# EAGLE board Module_DIO (EAGLE 9.2.1)
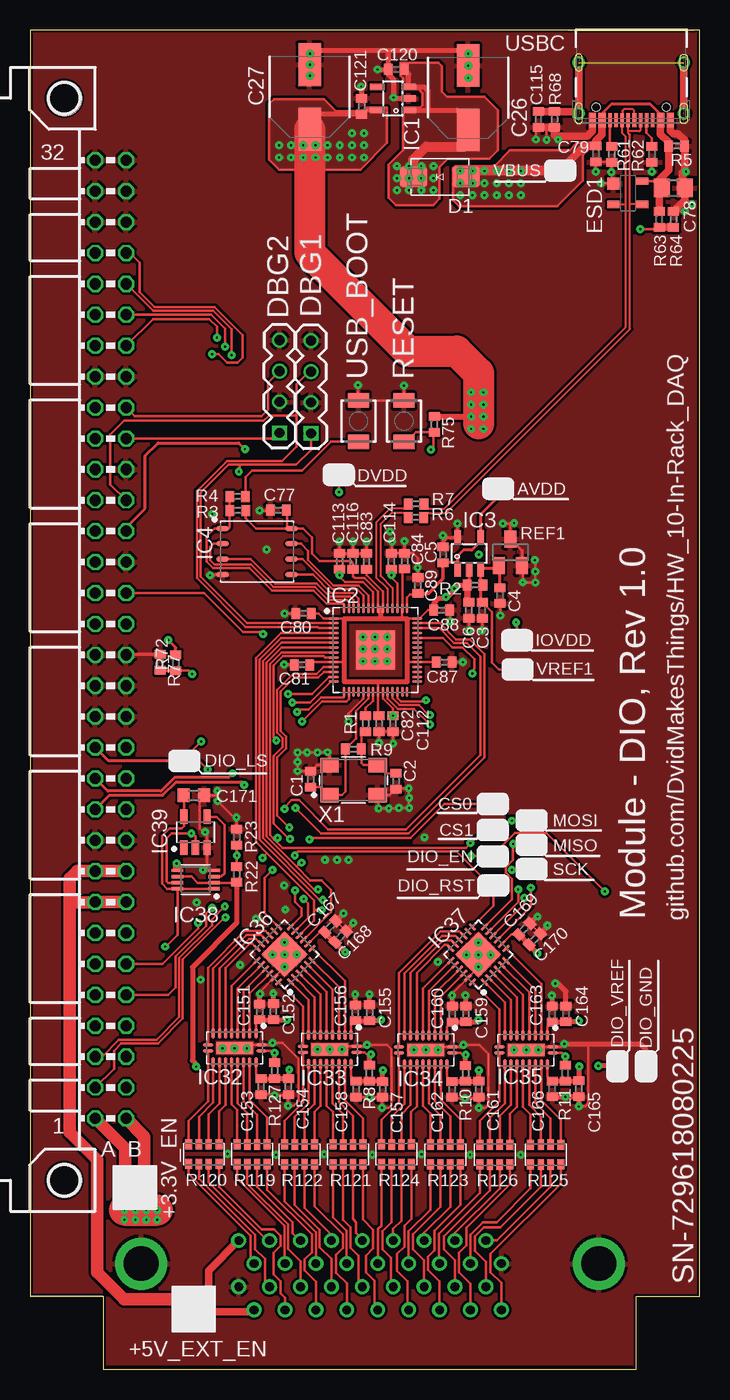
[diagram p3: board, top side]
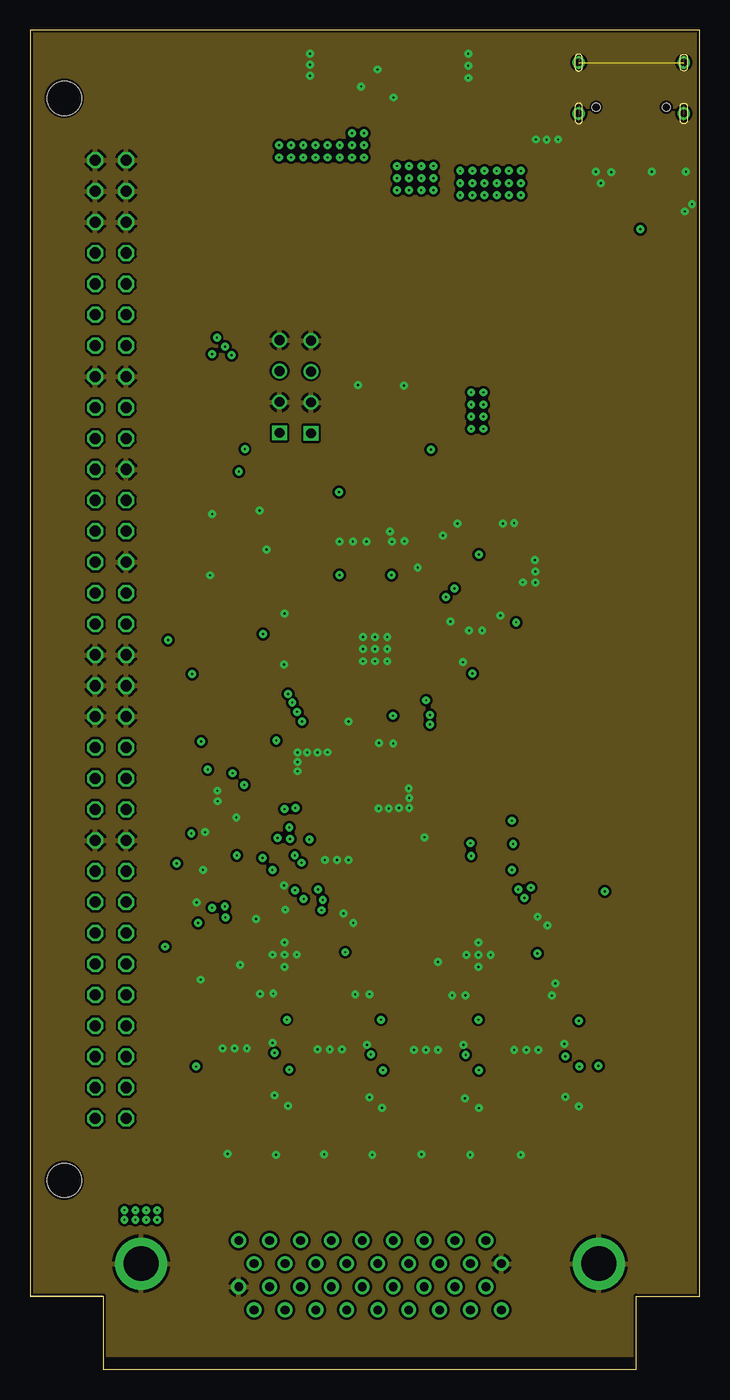
[diagram p4: board, inner layer Route2]
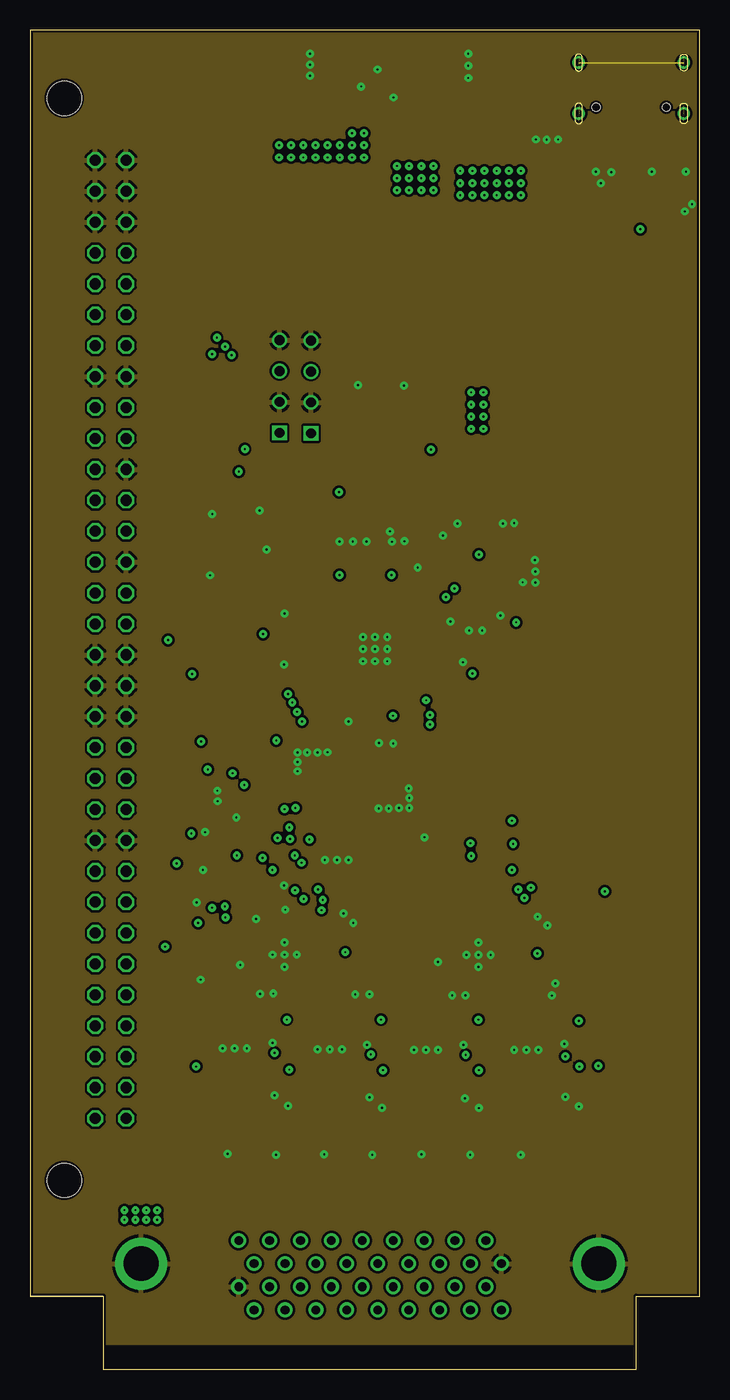
[diagram p5: board, inner layer Route15]
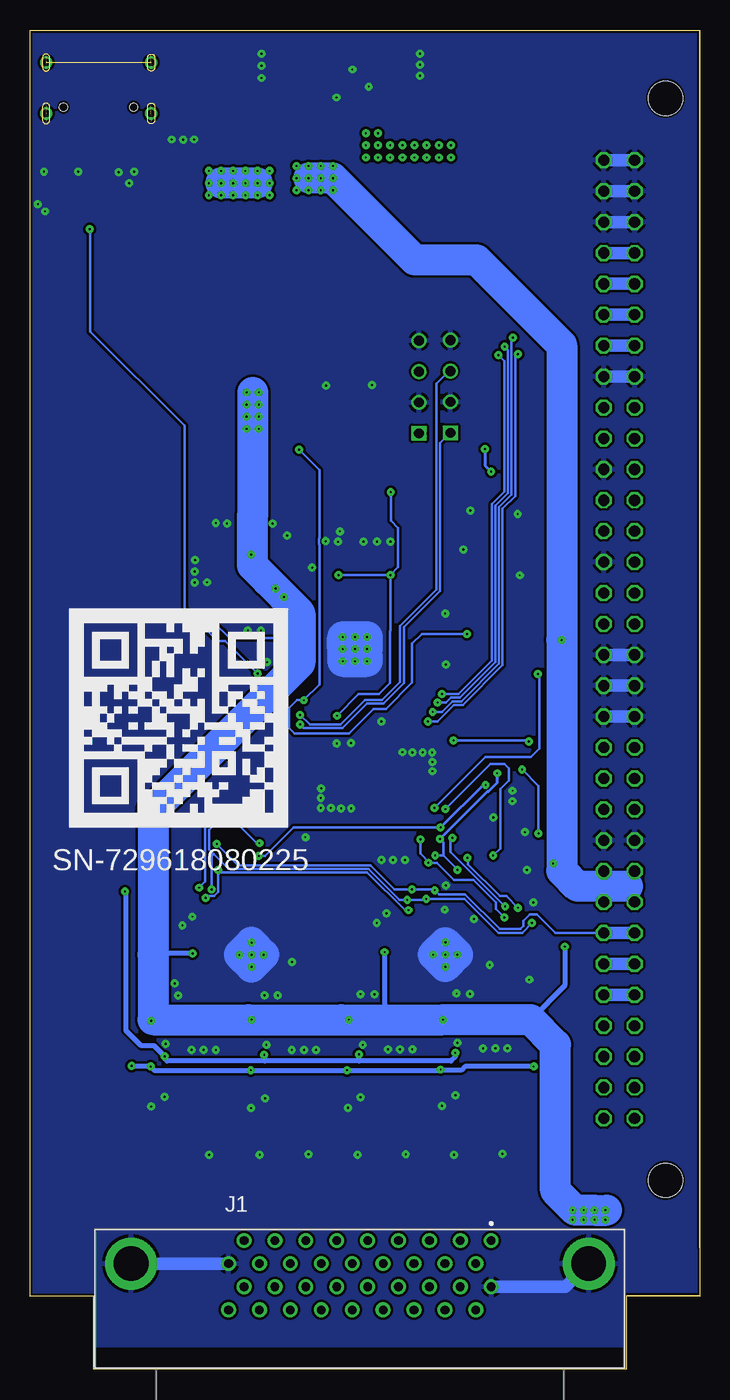
[diagram p6: board, bottom side, seen from below]

Size 55 x 110 mm. Coordinates in mm from the lower left corner, seen from the top.
Outline: 0,6 6,6
Outline: 0,6 6,6 6,0 49.8,0 49.8,6 55,6 55,110 0,110 0,6
Copper layers (1+2*15+16): Top 0.035mm / dielectric 0.0994mm / Route2 0.0152mm / dielectric 1.265mm / Route15 0.0152mm / dielectric 0.0994mm / Bottom 0.035mm
Design rules "JLC04161H-3313": minimum track width 3.5mil, minimum drill 0.15mm, track to track 3.5mil, track to pad 3.5mil, pad to pad 3.5mil, via to via 3.5mil, smd to smd 3.5mil, copper to edge 0.2mm, drill to drill 6mil, minimum pad ring 8mil, minimum via ring 0.25mm, stop-mask expansion 0.05mm, vias tented up to drill 16mil, thermal gap 10mil
Net classes: 1 50R_DIFFPAIR: width 0.4 mm, drill 0.15 mm, clearance 0.203 mm; 2 90R_DIFFPAIR: width 0.155 mm, drill 0.15 mm, clearance 0.191 mm; 3 100R_DIFFPAIR: width 0.221 mm, drill 0.15 mm, clearance 0.203 mm

## Footprints (pad centres in the part's own frame; a part is rotated, then mirrored left to right if it is on the bottom)
TP = smd 2.2 x 1.4: TP 0,0
C0402 = smd 0.7 x 0.9: 1 -0.65,0; 2 0.65,0
100UF-16V = smd 3.5 x 1.85: 1 -2.65,0; 2 2.65,0
0805 = smd 1.3 x 1.5: 1 -0.95,0; 2 0.95,0
0402 = smd 0.7 x 0.9: 1 -0.65,0; 2 0.65,0
C0603 = smd 1 x 1.1: 1 -0.85,0; 2 0.85,0
SMA = smd 2.28 x 1.66: A 2.165,0; C -2.165,0
1X4 = drill 0.8 square: 1 0,3.81 | drill 0.8: 2 0,1.27; 3 0,-1.27; 4 0,-3.81
SOT143 = smd 1 x 1: 1 -0.75,-1.2 | smd 0.6 x 1: 2 0.95,-1.2; 3 0.95,1.2; 4 -0.95,1.2
SOT23-5 = smd 0.55 x 1.2: 1 -0.95,-1.3; 2 0,-1.3; 3 0.95,-1.3; 4 0.95,1.3; 5 -0.95,1.3
QFN40P700X700X100-57T510 = smd 0.837 x 0.22: 1 -3.437,2.6; 2 -3.437,2.2; 3 -3.437,1.8; 4 -3.437,1.4; 5 -3.437,1; 6 -3.437,0.6; 7 -3.437,0.2; 8 -3.437,-0.2; 9 -3.437,-0.6; 10 -3.437,-1; 11 -3.437,-1.4; 12 -3.437,-1.8; 13 -3.437,-2.2; 14 -3.437,-2.6; 29 3.437,-2.6; 30 3.437,-2.2; 31 3.437,-1.8; 32 3.437,-1.4; 33 3.437,-1; 34 3.437,-0.6; 35 3.437,-0.2; 36 3.437,0.2; 37 3.437,0.6; 38 3.437,1; 39 3.437,1.4; 40 3.437,1.8; 41 3.437,2.2; 42 3.437,2.6 | smd 0.22 x 0.837: 15 -2.6,-3.437; 16 -2.2,-3.437; 17 -1.8,-3.437; 18 -1.4,-3.437; 19 -1,-3.437; 20 -0.6,-3.437; 21 -0.2,-3.437; 22 0.2,-3.437; 23 0.6,-3.437; 24 1,-3.437; 25 1.4,-3.437; 26 1.8,-3.437; 27 2.2,-3.437; 28 2.6,-3.437; 43 2.6,3.437; 44 2.2,3.437; 45 1.8,3.437; 46 1.4,3.437; 47 1,3.437; 48 0.6,3.437; 49 0.2,3.437; 50 -0.2,3.437; 51 -0.6,3.437; 52 -1,3.437; 53 -1.4,3.437; 54 -1.8,3.437; 55 -2.2,3.437; 56 -2.6,3.437 | smd 3.2 x 3.2: 57 0,0
SON127P600X500X75-8N = smd 1.012 x 0.432: 1 -2.85,1.905; 2 -2.85,0.635; 3 -2.85,-0.635; 4 -2.85,-1.905; 5 2.85,-1.905; 6 2.85,-0.635; 7 2.85,0.635; 8 2.85,1.905
VQFN20 = smd 0.27 x 0.838: 1 -0.25,2.196; 10 -0.25,-2.196; 11 0.25,-2.196; 20 0.25,2.196 | smd 0.838 x 0.27: 2 -1.196,1.75; 3 -1.196,1.25; 4 -1.196,0.75; 5 -1.196,0.25; 6 -1.196,-0.25; 7 -1.196,-0.75; 8 -1.196,-1.25; 9 -1.196,-1.75; 12 1.196,-1.75; 13 1.196,-1.25; 14 1.196,-0.75; 15 1.196,-0.25; 16 1.196,0.25; 17 1.196,0.75; 18 1.196,1.25; 19 1.196,1.75 | smd 1 x 3: PAD 0,0
QFN50P400X400X100-25T265 = smd 0.811 x 0.264: 1 -1.951,1.25; 2 -1.951,0.75; 3 -1.951,0.25; 4 -1.951,-0.25; 5 -1.951,-0.75; 6 -1.951,-1.25; 13 1.951,-1.25; 14 1.951,-0.75; 15 1.951,-0.25; 16 1.951,0.25; 17 1.951,0.75; 18 1.951,1.25 | smd 0.264 x 0.811: 7 -1.25,-1.951; 8 -0.75,-1.951; 9 -0.25,-1.951; 10 0.25,-1.951; 11 0.75,-1.951; 12 1.25,-1.951; 19 1.25,1.951; 20 0.75,1.951; 21 0.25,1.951; 22 -0.25,1.951; 23 -0.75,1.951; 24 -1.25,1.951 | smd 2.65 x 2.65: 25 0,0
SOP50P310X90-8N = smd 0.923 x 0.268: 1 -1.503,0.75; 2 -1.503,0.25; 3 -1.503,-0.25; 4 -1.503,-0.75; 5 1.503,-0.75; 6 1.503,-0.25; 7 1.503,0.25; 8 1.503,0.75
SOT95P280X145-5N = smd 1.186 x 0.597: 1 -1.264,0.95; 2 -1.264,0; 3 -1.264,-0.95; 4 1.264,-0.95; 5 1.264,0.95
MDB36 = drill 0.71 pad 1.217: 1 10.16,8.89; 2 8.89,6.99; 3 7.62,8.89; 4 6.35,6.99; 5 5.08,8.89; 6 3.81,6.99; 7 2.54,8.89; 8 1.27,6.99; 9 0,8.89; 10 -1.27,6.99; 11 -2.54,8.89; 12 -3.81,6.99; 13 -5.08,8.89; 14 -6.35,6.99; 15 -7.62,8.89; 16 -8.89,6.99; 17 -10.16,8.89; 18 -11.43,6.99; 19 10.16,5.09; 20 8.89,3.19; 21 7.62,5.09; 22 6.35,3.19; 23 5.08,5.09; 24 3.81,3.19; 25 2.54,5.09; 26 1.27,3.19; 27 0,5.09; 28 -1.27,3.19; 29 -2.54,5.09; 30 -3.81,3.19; 31 -5.08,5.09; 32 -6.35,3.19; 33 -7.62,5.09; 34 -8.89,3.19; 35 -10.16,5.09; 36 -11.43,3.19 | drill 2.85 pad 4.275: MH1 18.17,6.99; MH2 -19.44,6.99
0603 = smd 1 x 1.1: 1 -0.85,0; 2 0.85,0
YC164-JR-0733RL = smd 0.67 x 0.85: 1 -1.24,-0.81; 4 1.24,-0.81; 5 1.24,0.81; 8 -1.24,0.81 | smd 0.59 x 0.85: 2 -0.4,-0.81; 3 0.4,-0.81; 6 0.4,0.81; 7 -0.4,0.81
SOT23 = smd 1 x 1.4: 1 -0.95,-1.1; 2 0.95,-1.1; 3 0,1.1
SWITCH-OMRON_B3U-1000P = smd 1.2 x 1.7: 1 -1.7,0; 2 1.7,0
629722000214 = smd 0.3 x 1.15: A1 -3.35,4.745; A4 -2.55,4.745; A5 -1.25,4.745; A6 -0.25,4.745; A7 0.25,4.745; A8 1.25,4.745; A9 2.55,4.745; A12 3.35,4.745; B1 3.05,4.745; B4 2.25,4.745; B5 1.75,4.745; B6 0.75,4.745; B7 -0.75,4.745; B8 -1.75,4.745; B9 -2.25,4.745; B12 -3.05,4.745 | drill 0.6 pad 1: S1 -4.32,4.18; S2 4.32,4.18; S3 -4.32,0; S4 4.32,0 | hole 0.65: -2.89,3.68; 2.89,3.68
OSCCC500X320X130 = smd 1.487 x 1.187: 1 -1.988,-1.238; 2 1.988,-1.238; 3 1.988,1.238; 4 -1.988,1.238
CON-VG_MAB64 = drill 0.914 octagon: A1 -2.54,39.37; A2 -2.54,36.83; A3 -2.54,34.29; A4 -2.54,31.75; A5 -2.54,29.21; A6 -2.54,26.67; A7 -2.54,24.13; A8 -2.54,21.59; A9 -2.54,19.05; A10 -2.54,16.51; A11 -2.54,13.97; A12 -2.54,11.43; A13 -2.54,8.89; A14 -2.54,6.35; A15 -2.54,3.81; A16 -2.54,1.27; A17 -2.54,-1.27; A18 -2.54,-3.81; A19 -2.54,-6.35; A20 -2.54,-8.89; A21 -2.54,-11.43; A22 -2.54,-13.97; A23 -2.54,-16.51; A24 -2.54,-19.05; A25 -2.54,-21.59; A26 -2.54,-24.13; A27 -2.54,-26.67; A28 -2.54,-29.21; A29 -2.54,-31.75; A30 -2.54,-34.29; A31 -2.54,-36.83; A32 -2.54,-39.37; B1 -5.08,39.37; B2 -5.08,36.83; B3 -5.08,34.29; B4 -5.08,31.75; B5 -5.08,29.21; B6 -5.08,26.67; B7 -5.08,24.13; B8 -5.08,21.59; B9 -5.08,19.05; B10 -5.08,16.51; B11 -5.08,13.97; B12 -5.08,11.43; B13 -5.08,8.89; B14 -5.08,6.35; B15 -5.08,3.81; B16 -5.08,1.27; B17 -5.08,-1.27; B18 -5.08,-3.81; B19 -5.08,-6.35; B20 -5.08,-8.89; B21 -5.08,-11.43; B22 -5.08,-13.97; B23 -5.08,-16.51; B24 -5.08,-19.05; B25 -5.08,-21.59; B26 -5.08,-24.13; B27 -5.08,-26.67; B28 -5.08,-29.21; B29 -5.08,-31.75; B30 -5.08,-34.29; B31 -5.08,-36.83; B32 -5.08,-39.37 | hole 2.794: 0,44.45; 0,-44.45

## Placement (x,y rotation side)
AVDD  TP  [TP]  38.44,72.33 0 top
C1  15pF  [C0402]  23.04,48.47 90 top
C2  15pF  [C0402]  30.05,48.3 270 top
C3  1uF  [C0402]  37.15,62.35 270 top
C4  100nF  [C0402]  38.6,63.56 270 top
C5  100nF  [C0402]  33.92,66.91 90 top
C6  100nF  [C0402]  36.04,62.35 270 top
C26  100uF 16V  [100UF-16V]  35.97,104.46 90 top
C27  100uF 16V  [100UF-16V]  22.94,104.53 90 top
C77  100nF  [C0402]  20.37,70.58 180 top
C78  10uF  [0805]  52.85,97.05 0 top
C79  100nF  [0402]  46.49,99.84 270 top
C80  100nF  [C0402]  22.46,62.1 180 top
C81  100nF  [C0402]  22.33,57.87 180 top
C82  100nF  [C0402]  28.66,53.02 270 top
C83  100nF  [C0402]  27.62,66.38 90 top
C84  100nF  [C0402]  30.76,66.39 90 top
C87  100nF  [C0402]  34.01,58.09 0 top
C88  100nF  [C0402]  33.81,62.37 0 top
C89  100nF  [C0402]  31.84,64.39 90 top
C112  100nF  [C0402]  29.8,53.03 270 top
C113  100nF  [C0402]  25.42,66.38 90 top
C114  100nF  [C0402]  29.67,66.38 90 top
C115  4.7nF  [0402]  41.75,102.69 270 top
C116  100nF  [C0402]  26.52,66.38 90 top
C120  100nF  [C0402]  30.07,106.8 180 top
C121  100nF  [C0402]  27.22,103.77 90 top
C151  1uF  [C0402]  18.84,29.35 90 top
C152  100nF  [C0402]  19.98,29.36 90 top
C153  1uF  [C0402]  18.96,23.21 270 top
C154  100nF  [C0402]  21.21,23.21 270 top
C155  1uF  [C0402]  27.88,29.29 90 top
C156  100nF  [C0402]  26.72,29.27 90 top
C157  1uF  [C0402]  28.94,22.99 270 top
C158  100nF  [C0402]  26.77,23.02 270 top
C159  1uF  [C0402]  35.8,29.18 90 top
C160  100nF  [C0402]  34.68,29.18 90 top
C161  1uF  [C0402]  36.85,23 270 top
C162  100nF  [C0402]  34.66,22.99 270 top
C163  1uF  [C0402]  42.88,29.16 90 top
C164  100nF  [C0402]  44.02,29.18 90 top
C165  1uF  [C0402]  45.07,23.04 270 top
C166  100nF  [C0402]  42.89,23.02 270 top
C167  1uF  [C0402]  24.65,36.36 45 top
C168  100nF  [C0402]  25.49,35.53 45 top
C169  1uF  [C0402]  40.59,36.17 45 top
C170  100nF  [C0402]  41.45,35.33 45 top
C171  100nF  [C0603]  13.44,47.14 0 top
CS0  TP  [TP]  38.01,46.44 180 top
CS1  TP  [TP]  38.01,44.29 180 top
D1  SS12  [SMA]  33.64,97.96 0 top
DBG1  [1X4]  23.06,80.7 180 top
DBG2  [1X4]  20.48,80.74 180 top
DIO_EN  TP  [TP]  38.04,42.12 180 top
DIO_GND  TP  [TP]  50.59,24.89 90 top
DIO_LS  TP  [TP]  12.68,49.99 0 top
DIO_RST  TP  [TP]  38.06,39.72 180 top
DIO_VREF  TP  [TP]  48.24,24.9 90 top
DVDD  TP  [TP]  25.38,73.47 0 top
ESD1  SP0503BAHTG-ES  [SOT143]  49.1,96.66 270 top
IC1  MIC5504-3.3YM5-TR  [SOT23-5]  29.79,104.41 90 top
IC2  RP2040  [QFN40P700X700X100-57T510]  28.37,59.09 0 top
IC3  MCP6001AIDBVRG  [SOT23-5]  36.07,67.03 0 top
IC4  W25Q128JVPIQ  [SON127P600X500X75-8N]  18.63,67.18 0 top
IC32  LSF0108  [VQFN20]  16.78,26.39 270 top
IC33  LSF0108  [VQFN20]  24.6,26.27 270 top
IC34  LSF0108  [VQFN20]  32.5,26.23 270 top
IC35  LSF0108  [VQFN20]  40.74,26.22 270 top
IC36  MCP23S18  [QFN50P400X400X100-25T265]  20.89,34.08 135 top
IC37  MCP23S18  [QFN50P400X400X100-25T265]  36.82,34.06 135 top
IC38  SN74LVC2G66  [SOP50P310X90-8N]  13.59,40.21 180 top
IC39  74LVC1G04  [SOT95P280X145-5N]  13.56,44.11 90 top
IOVDD  TP  [TP]  39.99,59.89 0 top
J1  [MDB36]  27.28,1.68 0 bottom
JP-3V3-1  0R  [0603]  7.79,14.9 90 top
JP-3V3-2  0R  [0603]  9.37,14.89 90 top
JP-EXT-1  0R  [0603]  13.4,5.72 0 top
JP-EXT-2  0R  [0603]  13.41,4.08 0 top
MISO  TP  [TP]  41.22,43.07 0 top
MOSI  TP  [TP]  41.2,45.07 0 top
R1  1K  [0402]  27.56,53.04 90 top
R2  4.7K  [0402]  36.54,64.42 180 top
R3  DNI  [0402]  17.04,70.55 0 top
R4  1K  [0402]  17.03,71.7 180 top
R5  2.2K 1%  [0402]  53.12,100.5 0 top
R6  27R  [0402]  31.69,69.97 180 top
R7  27R  [0402]  31.7,71.08 180 top
R8  200K  [0402]  27.86,24.33 90 top
R9  0R  [0402]  26.55,50.95 0 top
R10  200K  [0402]  35.77,24.3 90 top
R11  200K  [0402]  43.97,24.32 90 top
R22  10K  [0402]  16.96,40.64 90 top
R23  10K  [0402]  16.95,43.71 90 top
R61  5.1K  [0402]  47.77,99.81 270 top
R62  5.1K  [0402]  51.09,99.82 270 top
R63  10K  [0402]  51.68,94.46 270 top
R64  10K  [0402]  52.86,94.47 90 top
R68  1M  [0402]  43.08,102.69 270 top
R72  10K  [0402]  11.95,58.05 90 top
R75  10K  [0402]  33.2,77.62 270 top
R77  10K  [0402]  10.67,58.07 270 top
R119  YC164-JR-0733RL  [YC164-JR-0733RL]  18.22,17.65 180 top
R120  YC164-JR-0733RL  [YC164-JR-0733RL]  14.26,17.66 180 top
R121  YC164-JR-0733RL  [YC164-JR-0733RL]  26.11,17.64 180 top
R122  YC164-JR-0733RL  [YC164-JR-0733RL]  22.13,17.64 180 top
R123  YC164-JR-0733RL  [YC164-JR-0733RL]  34.11,17.64 180 top
R124  YC164-JR-0733RL  [YC164-JR-0733RL]  30.09,17.65 180 top
R125  YC164-JR-0733RL  [YC164-JR-0733RL]  42.35,17.63 180 top
R126  YC164-JR-0733RL  [YC164-JR-0733RL]  38.17,17.63 180 top
R127  200K  [0402]  20.08,24.52 90 top
REF1  LM4040BXX  [SOT23]  39.45,67.11 0 top
RESET  B3U-1000P-B  [SWITCH-OMRON_B3U-1000P]  30.7,77.89 90 top
SCK  TP  [TP]  41.2,41.07 0 top
USB_BOOT  B3U-1000P-B  [SWITCH-OMRON_B3U-1000P]  26.96,77.9 90 top
USBC  USB-TYPE-C-018  [629722000214]  49.39,107.36 180 top
VBUS  TP  [TP]  43.55,98.49 180 top
VREF1  TP  [TP]  40.06,57.49 0 top
X1  K5A1200015304P  [OSCCC500X320X130]  26.56,48.4 0 top
X3  CON-VG_MAB64  [CON-VG_MAB64]  2.79,59.96 180 top

## Tracks (layer width: path | path; a pad name or v marks a point on that pad's centre or on a via)
!DIO_LEVEL_SELECT
  Top 0.203: IC38.3 15.68,40.46 15.96,40.74 15.96,44.72 15.31,45.37 IC39.4
!QSPI_SS
  Top 0.2: IC2.56 25.77,62.82 25.68,62.91 24.36,62.91 23.29,63.97 19.85,63.97 18.01,65.82 15,65.82 14.48,66.34 14.48,68.44 15.12,69.08 IC4.1
  Top 0.203: R4.2 R3.1 16.39,69.19 16.28,69.08 IC4.1
+1V1  (via drill 0.15)
  Top 0.2: IC2.45 30.17,64.53 29.67,65.03 | v29.67,65.26 C114.1 | IC2.50 28.17,63.84 27.34,64.67 25.84,64.67 25.41,65.09 v25.41,65.26 C113.1
  Top 0.203: IC2.23 28.97,55.1 29.8,54.26 C112.1 | 29.67,65.03 v29.67,65.26 | DVDD.TP v25.38,72.06
  Bottom 0.203: C112.1 28.03,55.46 26.33,55.46 25.43,56.36 25.43,60.66 25.41,60.67 v25.41,65.26 | v25.41,65.26 v29.67,65.26 | v25.38,72.06 25.38,69.71 24.78,69.11 24.78,65.89 v25.41,65.26
  other vias: 29.8,53.68
+3V3  (via drill 0.15)
  Top 0.2: IC2.44 30.57,65.55 C84.1 | C83.1 27.62,65.24 28.97,63.89 IC2.48 28.76,62.52 IC2.49 28.57,63.88 27.47,64.98 26.68,64.98 26.52,65.14 C116.1 26.52,66.21 26.35,66.38 23.75,66.38 23.13,67 23.13,68.35 22.39,69.08 IC4.8 | C88.1 32.66,62.37 31.98,61.69 IC2.42 30.95,61.69 30.95,61.59
  Top 0.203: IC2.44 30.55,62.52 30.55,61.64 | 25.79,61.64 25.79,61.69 IC2.1 24.08,61.69 23.66,62.1 C80.1 | 25.79,58.11 25.79,58.09 IC2.10 23.2,58.09 C81.1 | IC2.22 28.55,55.65 | 30.95,58.06 30.95,58.09 IC2.33 C87.1 | IC2.22 28.57,53.67 C82.1 | IC2.22 28.57,56.48 28.58,56.48 | 21.08,69.08 18.55,69.08 17.69,69.94 R3.2 | 21.08,69.08 IC4.8 | C77.1 21.08,70.52 21.08,69.08 | IC35.2 42.49,28.12 C163.1 | IC34.2 34.25,28.1 C160.1 | IC33.2 26.35,28.25 C156.1 | IC32.2 18.53,28.39 C151.1 | IC37.8 39.52,35.71 C169.1 | IC36.8 23.77,35.9 C167.1 25.01,35.07 C168.1 25.19,34.92 25.85,34.26 v25.88,34.26 | C171.1 12.62,47.11 IC39.5 12.62,44.61 12.43,44.43 11.45,44.43 10.82,43.8 10.82,39.89 11.25,39.46 IC38.8 | IC38.8 IC38.1 | 27.43,103.46 27.63,103.66 29.33,103.66 29.33,100.76 27.13,98.56 20.43,98.56 19.63,99.36 19.63,103.96 20.03,104.36 24.13,104.36 25.13,103.36 27.33,103.36 27.43,103.46 | C121.1 27.43,103.33 27.43,103.46 | 34.2,63.34 34.2,63.43 v34.16,63.43 | IOVDD.TP 39.99,61.3 v39.93,61.36 | IC38.8 12.09,35.67 11.13,34.71 v11.08,34.71 | IC2.48 IC2.49
  Top 0.254: IC3.2 36.04,65.7 36.04,64.42 | 36.04,64.42 C6.1 | R2.2 36.03,64.42 36.04,64.42
  Top 0.406: C88.1 33.16,62.9 33.59,63.34 34.2,63.34 35.28,64.42 R2.2 35.89,63.14 C6.1 | 28.76,62.52 28.76,61.64 25.79,61.64 25.79,58.11 25.79,56.48 28.58,56.48 30.95,56.48 30.95,58.06 30.95,61.59 30.95,61.64 30.55,61.64 28.32,61.64 | C151.1 C152.1 v21.08,28.71 | C156.1 27.86,28.62 C155.1 28.76,28.64 v28.83,28.71 | C160.1 35.79,28.52 C159.1 36.66,28.54 v36.83,28.71 | C163.1 44,28.51 C164.1 45,28.54 v45.08,28.61 | IC1.5 27.56,103.45 C121.1 23.33,103.11 22.93,102.71 22.94,102.69 C27.1 | C167.1 25.17,34.92 25.19,34.92 | C168.1 25.85,34.26 | C169.1 40.15,35.71 C170.1 41.68,34.18 v41.68,34.16
  Top 0.508: v37.23,80.26 v37.23,79.26 v36.23,79.26 v36.23,78.26 | v36.23,78.26 v37.23,78.26 v37.23,77.26 | v37.23,77.26 v36.23,77.26 | 36.83,77.66 v37.23,77.26 | R75.1 36.21,78.27 v36.23,78.26
  Top 1.016: JP-3V3-1.1 8.53,14.05 | 8.53,14.05 9.36,14.05 JP-3V3-2.1 | 8.53,14.05 8.63,13.95 v8.63,13.06
  Top 2.54: C27.1 22.94,91.74 31.03,83.66 35.03,83.66 36.83,81.86 36.83,77.66 | v7.73,13.06 v10.43,13.06
  Bottom 0.203: 36.77,66.05 36.77,66.93 v36.86,66.93 | 35.51,64.78 34.86,64.78 v34.86,64.13 34.86,63.43 v34.16,63.43 | v39.93,61.36 38.63,60.06 32.84,60.06
  Bottom 0.305: v7.73,12.26 7.83,12.26 v8.63,13.06 | v8.63,12.26 v8.63,13.06 | v9.53,12.26 8.73,13.06 v8.63,13.06 | v10.43,12.26 v10.43,13.06 | v9.53,13.06 v8.63,13.06 | v7.73,13.06 v8.63,13.06
  Bottom 0.406: v28.83,28.71 25.83,28.71 25.88,28.76 v25.88,34.26 | v41.68,34.16 44.83,34.16 44.93,34.06 | v28.83,28.71 29.43,28.71 | v36.83,28.71 37.08,28.71 | v45.08,28.61 44.98,28.71 44.93,28.71 | v21.08,28.71 v28.83,28.71 | v11.08,34.71 11.08,31.51 13.88,28.71 | v10.43,13.06 10.23,13.06
  Bottom 0.508: v37.23,80.26 36.73,80.26 v36.23,80.26
  Bottom 2.54: 36.73,80.26 36.73,70.22 36.77,70.17 36.77,66.05 35.51,64.78 v34.16,63.43 32.84,62.12 32.84,60.06 32.84,58.01 44.93,45.92 44.93,34.06 44.93,28.71 37.08,28.71 29.43,28.71 25.83,28.71 v21.08,28.71 13.88,28.71 11.83,26.66 11.83,14.66 10.23,13.06 v8.63,13.06 7.63,13.06
  other vias: 20.43,100.56 20.43,99.56 21.43,99.56 22.43,99.56 23.43,99.56 24.43,99.56 25.43,99.56 26.43,99.56 27.43,99.56 27.43,100.56 26.43,100.56 25.43,100.56 24.43,100.56 23.43,100.56 22.43,100.56 21.43,100.56 26.43,101.56 27.43,101.56
  pour Top (isolate 0.203, no thermals): 24.13,104.36 20.03,104.36 19.63,103.96 19.63,99.36 20.43,98.56 27.13,98.56 29.33,100.76 29.33,103.66 27.63,103.66 27.33,103.36 25.13,103.36
+5V  (via drill 0.15)
  Top 0.203: 12.09,41.16 IC38.5 | 30.63,103.66 32.03,103.66 32.23,103.86 32.23,104.86 31.93,105.16 30.63,105.16 30.63,106.06 30.43,106.26 30.43,107.36 33.53,107.36 33.83,107.06 33.83,104.96 34.23,104.56 37.33,104.56 38.43,103.46 38.43,100.16 37.73,99.46 34.33,99.46 33.63,98.76 33.63,96.16 33.13,95.66 30.03,95.66 29.43,96.26 29.43,98.96 30.63,100.16 30.63,103.66
  Top 0.254: R72.2 11.95,59.29 v11.33,59.91
  Top 0.406: C120.1 31.09,106.43 IC1.3 32.34,105.35 32.68,105.01 32.68,103.45 | IC1.1 32.68,103.45 | 32.68,103.45 35.09,103.45 35.97,102.57 C26.1
  Top 0.61: JP-EXT-1.1 | v12.03,41.56 12.03,41.22 12.09,41.16
  Top 0.813: D1.C 31.48,99.41 32.53,100.46 35.73,100.46 35.97,100.7 C26.1
  Top 1.016: JP-EXT-2.1 JP-EXT-1.1 | JP-EXT-1.1 7.72,5.72 5.48,7.96 5.48,17.21 3.23,19.46 3.23,38.16 | 3.23,38.16 3.43,38.36 X3.A8 X3.B8 | 3.23,38.16 3.23,40.31 3.83,40.91 X3.A9 X3.B9
  Bottom 0.203: X3.A8 5.33,39.06 5.93,39.66 5.93,40.32 X3.A9 | X3.B8 7.87,39.47 7.68,39.66 7.63,39.71 7.63,40.67 X3.B9 | v12.03,41.56 11.93,41.56 11.33,40.96
  Bottom 2.54: v32.13,97.86 v31.13,97.86 v30.13,97.86 23.43,91.16 18.33,91.16 11.33,84.16 v11.33,59.91 11.33,40.96 10.03,39.66 7.68,39.66 5.93,39.66
  other vias: 30.13,98.86 30.13,96.86 31.13,96.86 31.13,98.86 32.13,98.86 32.13,96.86 33.13,96.86 33.13,97.86 33.13,98.86
  pour Top (isolate 0.203, no thermals): 30.63,103.66 32.03,103.66 32.23,103.86 32.23,104.86 31.93,105.16 30.63,105.16 30.63,106.06 30.43,106.26 30.43,107.36 33.53,107.36 33.83,107.06 33.83,104.96 34.23,104.56 37.33,104.56 38.43,103.46 38.43,100.16 37.73,99.46 34.33,99.46 33.63,98.76 33.63,96.16 33.13,95.66 30.03,95.66 29.43,96.26 29.43,98.96 30.63,100.16 30.63,103.46
ADC_5VP  (via drill 0.15)
  Top 0.203: IC2.41 33.65,61.29 34.98,59.96 36.13,59.96 37.33,58.76 37.33,50.26 31.08,44.01 23.88,44.01 v21.78,46.11 | v13.28,57.11 12.99,57.4 R72.1
  Top 0.254: R77.2 11.93,57.42 R72.1
  Bottom 0.203: v21.78,46.11 17.58,50.31 13.88,50.31 13.18,51.01 13.18,57.01 v13.28,57.11
ADC_VOUT_REF  (via drill 0.15)
  Top 0.203: R23.1 16.96,43.05 v16.96,42.21 R22.2 | IC2.40 33.6,60.89 34.83,59.66 35.88,59.66 36.98,58.56 36.98,50.46 30.88,44.36 24.48,44.36 22.08,46.76 21.48,46.76 20.88,46.16 v20.88,46.01
  Bottom 0.203: v20.88,46.01 17.18,49.71 16.03,49.71 15.68,49.36 15.68,48.36 16.38,47.66 16.38,42.79 v16.96,42.21
ADC_VUSB  (via drill 0.15)
  Top 0.203: IC2.38 33.9,60.09 34.68,59.31 35.53,59.31 36.48,58.36 36.48,57.56 36.33,57.41 v36.33,57.16 | v50.13,93.66 51.53,93.66 R63.2
  Top 0.61: R63.2 51.7,93.83 R64.1
  Bottom 0.203: v36.33,57.16 38.98,59.81 39.63,59.81 42.33,62.51 42.33,77.51 50.08,85.26 50.08,93.61 v50.13,93.66
AVDD
  Top 0.2: IC2.43 30.97,63.39 31.2,63.63 31.73,63.63 C89.1
  Top 0.254: IC3.1 35.12,66.12 | C5.1 34.97,66.26 35.12,66.12 | 35.12,66.12 35.12,66.83 35.59,67.3 36.28,67.3 37.02,68.03 IC3.4 37.02,70.25 38.44,71.67 AVDD.TP
  Top 0.305: C89.1 32.71,63.74 33.92,64.95 C5.1
CC1
  Top 0.203: USBC.A5 50.64,101.6 51.09,101.15 R62.1
CC2
  Top 0.203: USBC.B5 47.64,100.6 R61.1
DIO_0
  Top 0.203: R120.5 13.02,16.02 18.08,10.96 18.08,8.98 J1.2
DIO_1
  Top 0.203: R120.6 13.86,15.65 18.48,11.02 18.48,9.86 19.29,9.05 19.29,7.14 J1.21
DIO_2
  Top 0.203: R120.7 14.65,15.36 19.45,10.57 J1.3
DIO_3
  Top 0.203: R120.8 15.49,14.98 19.01,11.46 20.04,11.46 20.56,10.95 20.56,10.13 19.98,9.56 19.98,7.78 20.56,7.2 20.56,6.23 20.93,5.86 J1.22
DIO_4
  Top 0.203: R119.5 16.98,15.65 20.88,11.76 20.88,8.72 J1.4
DIO_5
  Top 0.203: R119.6 17.82,15.23 21.17,11.88 21.17,9.87 22.2,8.84 J1.23
DIO_6
  Top 0.203: R119.7 18.62,14.96 21.53,12.06 21.53,11.16 22.12,10.57 J1.5
DIO_7
  Top 0.203: R119.8 19.46,14.72 23.13,11.06 23.13,9.61 22.53,9.01 22.53,8.11 23.47,7.17 J1.24
DIO_8
  Top 0.203: R122.5 20.89,13.8 23.47,11.22 J1.6
DIO_9
  Top 0.203: R122.6 21.73,13.51 23.78,11.46 23.78,10.01 24.74,9.05 J1.25
DIO_10
  Top 0.203: R122.7 22.53,13.26 24.74,11.05 J1.7
DIO_11
  Top 0.203: R122.8 23.37,13.37 25.68,11.06 25.68,9.96 25.13,9.41 25.13,7.91 26.01,7.03 J1.26
DIO_12
  Top 0.203: R121.5 24.87,12.47 25.98,11.36 25.98,8.7 J1.8
DIO_13
  Top 0.203: R121.6 25.71,12.28 26.33,11.66 26.33,9.96 26.98,9.31 26.98,7.07 J1.27
DIO_14
  Top 0.203: R121.7 26.51,12.33 26.78,12.06 26.78,11.21 27.28,10.71 J1.9
DIO_15
  Top 0.203: R121.8 27.35,12.29 28.18,11.46 28.18,9.91 27.58,9.31 27.58,7.96 28.28,7.26 28.28,5.14 J1.28
DIO_16
  Top 0.203: R124.5 28.85,11.79 28.58,11.51 28.58,8.7 J1.10
DIO_17
  Top 0.203: R124.6 29.69,12.07 28.93,11.31 28.93,9.86 29.63,9.16 29.63,6.96 J1.29
DIO_18
  Top 0.203: R124.7 30.49,12.19 29.82,11.52 J1.11
DIO_19
  Top 0.203: R124.8 31.34,12.37 30.73,11.76 30.73,10.06 30.13,9.46 30.13,8.06 30.98,7.21 30.98,4.98 J1.30
DIO_20
  Top 0.203: R123.5 32.87,13.1 31.08,11.31 31.08,9.36 31.09,9.35 J1.12
DIO_21
  Top 0.203: J1.31 32.36,8.93 31.43,9.86 31.43,11.06 33.71,13.34 R123.6
DIO_22
  Top 0.203: J1.13 32.36,11.19 34.51,13.34 R123.7
DIO_23
  Top 0.203: R123.8 35.35,13.48 33.23,11.36 33.23,9.76 32.68,9.21 32.68,8.16 33.63,7.21 J1.32
DIO_24
  Top 0.203: R126.5 36.93,14.46 33.58,11.11 33.58,8.72 J1.14
DIO_25
  Top 0.203: R126.6 37.77,14.71 33.98,10.91 33.98,9.86 34.9,8.94 J1.33
DIO_26
  Top 0.203: R126.7 38.57,14.86 34.9,11.18 J1.15
DIO_27
  Top 0.203: R126.8 39.41,15.2 35.83,11.61 35.83,10.16 35.23,9.56 35.23,7.96 36.17,7.02 J1.34
DIO_28
  Top 0.203: J1.16 36.17,11.05 37.18,12.06 38.33,12.06 41.11,14.85 R125.5
DIO_29
  Top 0.203: R125.6 41.95,14.98 38.63,11.66 37.28,11.66 36.53,10.91 36.53,9.71 37.44,8.8 J1.35
DIO_30
  Top 0.203: R125.7 42.75,14.98 38.34,10.57 J1.17
DIO_31
  Top 0.203: R125.8 43.59,15.22 37.83,9.46 37.83,7.96 38.71,7.08 J1.36
DIO_EN  (via drill 0.15)
  Top 0.203: IC32.20 19.92,26.14 v20.08,25.99 | IC33.20 27.44,26.02 27.86,25.61 27.86,25.6 R8.2 | IC34.20 35.35,25.98 35.8,25.54 35.77,25.5 R10.2 | IC35.20 43.7,25.97 v43.97,25.7 | IC2.12 24.12,57.29 23.65,56.82 21.7,56.82 20.57,55.69 20.57,52.44 21.02,51.99 21.02,50.99 20.28,50.25 20.28,45.51 v21.28,44.51 | v36.23,42.16 38,42.16 DIO_EN.TP 38.16,42.25 38.16,42.42 39.81,44.07 42.42,44.07 v47.23,39.26
  Top 0.254: X3.A11 6.5,47.16 10.88,47.16 11.98,48.26 17.33,48.26 v17.58,48.01
  Top 0.406: R127.2 v20.08,25.99 | R11.2 v43.97,25.7 | R10.2 35.77,25.8 v35.78,25.81 | R8.2 27.86,25.74 v27.98,25.86
  Bottom 0.203: v36.23,42.16 35.73,42.16 33.38,44.51 v21.28,44.51
  Bottom 0.254: v17.58,48.01 17.78,48.01 v21.28,44.51
  Bottom 0.406: v20.08,25.99 20.08,25.66 20.43,25.31 27.98,25.31 | 27.98,25.31 35.73,25.31 | 35.73,25.31 43.78,25.31 43.97,25.5 v43.97,25.7 44.84,26.56 45.88,26.56 47.13,27.81 47.13,39.16 v47.23,39.26 | 35.73,25.31 35.73,25.76 v35.78,25.81 | 27.98,25.31 v27.98,25.86
DIO_LEVEL_SELECT  (via drill 0.15)
  Top 0.203: IC38.7 11.34,39.96 11.21,40.08 11.21,43.61 11.61,44 v13.23,44 13.32,44 13.56,43.76 IC39.2 | IC2.9 24.2,58.49 24.09,58.6 20.78,58.6 19.99,57.8 19.99,51.88 v20.21,51.66 | v14.03,51.56 12.68,50.21 DIO_LS.TP 13.85,49.99 v14.58,49.26
  Top 0.254: X3.A13 6.41,49.99 DIO_LS.TP
  Bottom 0.203: v20.21,51.66 14.13,51.66 v14.03,51.56 | v13.23,44 13.23,47.91 v14.58,49.26
DIO_RESET  (via drill 0.15)
  Top 0.203: IC37.13 38.06,38.06 DIO_RST.TP 37.81,39.72 35.01,42.53 21.98,42.53 21.73,42.28 v21.73,42.21 | IC2.11 24.11,57.69 23.53,57.11 21.58,57.11 20.28,55.81 20.28,52.32 20.73,51.87 20.73,51.11 19.99,50.37 19.99,44.84 21.3,43.53 v21.33,43.56 | v19.89,41.02 19.24,40.37 19.24,37.5 IC36.13
  Top 0.254: v16.63,48.96 16.27,48.6 11.84,48.6 10.74,47.5 6.36,47.5 X3.A12
  Bottom 0.203: v21.33,43.56 21.04,43.27 21.04,42.21 | 21.04,42.21 19.89,41.06 v19.89,41.02 | v21.73,42.21 21.04,42.21
  Bottom 0.254: v21.33,43.56 17.42,47.47 17.36,47.47 16.63,48.19 v16.63,48.96
EXT
  Top 0.61: JP-EXT-2.2 14.26,4.71 | 14.26,4.71 JP-EXT-1.2 | 14.26,4.71 14.63,4.71 | 14.63,4.71 18.23,4.71 J1.20 | 14.63,4.71 14.63,8.08 J1.1
GND  (via drill 0.15)
  Top 0.155: ESD1.1 47.86,97.44 47.77,97.53 R61.2 46.52,99.16 C79.2
  Top 0.2: C113.2 C116.2 C83.2 | C114.2 C84.2 31.45,67.04 31.84,66.65 C89.2 | USBC.B12 52.59,102.61 USBC.A1
  Top 0.203: USBC.A12 46.18,102.61 USBC.B1 | 20.89,33.61 20.89,33.02 IC36.23 18.84,30.97 18.84,30.8 | 36.82,33.31 36.82,33 IC37.23 34.68,30.86 34.68,30.7 | C169.2 41.89,35.79 C170.2 | C167.2 25.93,35.99 C168.2 | 14.33,44.01 13.91,44.43 13.91,46.76 C171.2 15.35,47.14 15.37,47.16 | 14.33,44.01 14.52,43.83 IC39.3 14.52,41.12 14.67,40.96 IC38.4 14.23,40.96 v14.18,41.01 | v23.61,26.27 IC33.PAD v25.61,26.27 25.86,26.52 IC33.1 27.55,26.52 v27.68,26.65 29.29,26.65 29.68,26.26 29.68,21.7 29.45,21.47 v28.89,21.47 28.89,22.26 | v17.79,26.36 18.07,26.64 IC32.1 19.75,26.64 v19.9,26.8 20.74,26.8 22.03,25.51 22.03,22.06 21.61,21.64 v21.18,21.64 21.18,22.54 C154.2 21.14,22.49 v20.07,22.49 19.99,22.57 C153.2 | v32.52,26.22 IC34.PAD 33.33,26.23 | 33.33,26.23 33.5,26.23 v33.52,26.22 | 33.33,26.23 33.58,26.48 IC34.1 35.45,26.48 v35.6,26.64 36.91,26.64 37.63,25.91 37.63,21.66 37.42,21.45 v36.86,21.45 36.86,22.34 C161.2 36.75,22.25 v35.73,22.25 34.75,22.25 C162.2 | 28.89,22.26 28.89,22.29 C157.2 | C158.2 26.82,22.32 v27.87,22.32 28.84,22.32 28.89,22.26 | v41.76,26.24 41.99,26.47 IC35.1 43.63,26.47 v43.88,26.72 45.88,26.72 45.88,21.86 45.59,21.57 v45.08,21.57 | v40.76,26.24 v40.76,26.23 IC35.PAD 40.73,26.24 v39.76,26.24 | v14.36,44.12 14.36,44.03 14.33,44.01 | v15.37,47.52 15.37,47.16 | 15.37,47.16 15.37,46.68 v15.38,46.66 16.73,45.31 v16.93,45.31 16.93,44.38 R23.2 | v28.66,51.45 v28.66,51.46 C82.2 28.67,52.38 C112.2 29.8,51.41 v29.82,51.39 | v20.85,57.9 21.66,57.9 C81.2 | v20.9,62.08 21.79,62.08 C80.2 | v25.4,67.99 25.4,67.04 C113.2 | v26.5,67.99 26.5,67.06 C116.2 | v27.63,68 C83.2
  Top 0.203: C114.2 29.71,67.08 v29.71,67.98 | C84.2 v30.75,68.02 | C5.2 33.92,68.47 v33.9,68.49 34.06,68.33 34.78,68.33 | v35.09,69.47 35.09,68.35 IC3.5 | v38.85,69.48 39.48,69.48 | 39.48,69.48 39.73,69.48 v39.76,69.52 | REF1.3 39.45,69.46 39.48,69.48 | v41.46,66.48 41.49,66.45 v41.49,65.54 v41.49,64.63 40.49,64.63 v40.46,64.66 40.46,65.95 REF1.2 | v38.63,61.91 38.63,62.88 C4.2 | v34.52,61.42 34.52,62.3 C88.2 | v36.06,60.69 36.06,61.67 C6.2 | v37.13,60.68 37.13,61.68 C3.2 | C87.2 v35.54,58.09 v35.55,58.08 | IC2.19 27.37,55.1 26.15,53.88 v26.15,53.21 | C77.2 19.69,70.55 v18.82,70.55 | IC4.4 14.83,65.27 v14.78,65.22 | v26.92,80.84 26.92,79.64 USB_BOOT.2 RESET.2 v30.7,80.81 | C79.2 46.49,98.4 v46.47,98.38 | v46.89,97.45 47.86,97.45 47.86,97.44 | v51.08,98.39 R62.2 | v53.88,98.38 53.77,98.38 | 53.64,98.38 53.57,98.31 | v54.38,95.73 54.05,96.06 53.8,96.06 | v53.8,95.13 R64.2 | C115.2 41.54,101.82 v41.54,101.04 | v42.43,101.02 v42.43,101.03 42.43,102.03 | C1.2 23.56,49.64 X1.4 24.57,50.53 v24.42,50.68 v23.6,50.68 v23.59,50.68 v22.76,50.68 v22.75,50.67 v21.97,50.67 21.97,49.92 v21.94,49.9 v21.95,49.89 v21.95,49.13 C1.2 | C2.2 29.56,47.16 X1.2 28.62,47.09 v28.62,46.06 v28.64,46.08 v29.45,46.08 30.28,46.08 v30.3,46.1 v31.12,46.1 v31.13,46.11 v31.13,46.93 31.13,47.67 v31.09,47.71 30.11,47.71 C2.2
  Top 0.254: C5.2 33.92,67.93 34.32,68.33 34.78,68.33 IC3.5 | REF1.3 40.4,67.26 REF1.2 | R77.1 7.9,58.72 X3.B16
  Top 0.406: C166.2 v43.96,22.37 v43.97,22.38 43.98,22.39 C165.2 45.07,21.59 v45.08,21.57 | IC32.PAD v16.78,26.36 v16.79,26.36 v17.79,26.36 | C151.2 18.84,30.8 v18.88,30.84 | C152.2 19.98,30.84 v19.96,30.86 | C156.2 26.7,29.94 v26.7,30.8 | C155.2 v27.88,30.8 | C160.2 34.68,30.7 v34.67,30.71 | C159.2 35.8,30.65 v35.75,30.7 | C163.2 42.88,30.68 v42.87,30.69 | C164.2 44.02,31.04 43.38,31.68 v43.16,31.68 | C167.2 25.72,37.44 v25.72,37.45 | C168.2 26.53,36.57 v26.53,36.67 | C169.2 41.6,37.17 v41.69,37.17 | C170.2 42.51,36.39 v42.51,36.45 | IC37.25 36.82,35.03 v36.83,35.04 | IC37.25 36.82,33.31 | v37.83,34.04 37.81,34.06 IC37.25 | IC36.25 20.89,33.61 | C27.2 22.94,108.34 22.93,108.36 29.38,108.36 | 29.38,108.36 35.73,108.36 35.97,108.12 C26.2 35.97,106.11 v35.99,106.09 | C120.2 29.42,108.31 29.38,108.36 | IC1.2 30.08,104.41 30,104.49 | 30,104.49 29.88,104.61 29.88,105.96 29.42,106.41 C120.2 | v29.84,104.49 30,104.49 | v27.19,105.39 27.22,105.36 C121.2 | v28.54,106.79 29.41,106.79 C120.2 | C27.2 22.94,106.33 v22.99,106.29 | C27.2 v22.98,107.18 v22.99,107.19 | C27.2 22.94,108.05 v22.99,108.09 | v43.88,26.72 50.12,26.72 50.58,26.26 50.58,24.91 DIO_GND.TP
  Top 0.61: 52.59,102.61 52.59,101.77 52.84,101.51 53.23,101.51 53.77,100.97 R5.2 53.77,98.38 | 53.57,98.31 53.57,97.28 C78.2 53.8,96.06 R64.2 | 46.18,102.61 46.18,101.73 45.78,101.33 43.2,101.33 43.08,101.44 R68.2 42.43,102.03 C115.2
  Bottom 0.406: v28.33,59.16 28.43,59.26 29.05,59.26 | v28.33,59.16 v27.33,60.16 | 27.33,58.56 27.93,59.16 v28.33,59.16 | v28.33,59.16 v29.33,58.16
  Bottom 1.016: J1.MH1 11.01,6.77 J1.19 | J1.18 J1.MH2 | X3.A30 X3.B30 | X3.A31 X3.B31 | X3.A32 X3.B32 | X3.A25 X3.B25 | X3.A16 X3.B16 | X3.A15 X3.B15 | X3.A14 X3.B14
  Bottom 2.54: v29.33,59.16 v29.33,60.16 | v20.89,33.05 v19.89,34.05 v20.89,35.05 v21.89,34.05 20.95,33.11 20.88,33.11 | v36.83,35.04 v35.83,34.04 v36.83,33.04 v37.83,34.04 v36.83,35.04 | v36.83,35.04 36.83,35.06 | v27.33,60.16 29.05,60.16 29.05,59.26 29.33,58.98 v29.33,58.16 v27.33,58.16 27.33,58.56 v27.33,59.16 v27.33,60.16
  other vias: 24.61,26.27 36.83,34.04 20.89,34.05 31.84,65.87 29.56,68.83 47.75,98.36 43.38,101.04 28.33,60.16 28.33,58.16 15.79,26.36 31.52,26.22 35.99,108.09 35.99,107.09 26.15,41.85 25.2,41.85 24.2,41.85 32.4,43.7 20.95,37.75 20.85,39.75 17.25,33.2 18.55,37 33.5,33.45 14,32 13.65,38.35 40.3,17.6 36.15,17.6 32.15,17.65 28.1,17.6 24.15,17.65 20.2,17.6 16.2,17.7 19.4,67.35 14.95,70.25
  pour Route15 (isolate 0.203): -3.67,2.16 -3.67,112.16 58.58,112.16 58.58,2.16
  pour Bottom (isolate 0.203): -3.37,2.01 -3.37,112.01 57.83,112.01 57.83,2.01
  pour Route2 (isolate 0.203): -4.12,1.16 -4.12,111.16 57.08,111.16 57.08,1.16
  pour Top (isolate 0.203): -4.87,0.46 -4.87,110.46 56.53,110.46 56.53,0.46
N$1
  Top 0.203: R1.1 27.2,52.03 R9.2 27.2,49.82 27.38,49.64 X1.3 29.23,48.95 C2.1
N$2
  Top 1.016: JP-3V3-2.2 9.37,19.1 X3.B1
N$4
  Top 1.016: JP-3V3-1.2 7.79,18.13 X3.A1
N$29
  Top 0.203: IC36.1 22.85,30.35 IC33.9
N$61
  Top 0.203: IC36.15 19.33,35.99 17.61,35.99 14.59,32.98 IC32.10
N$62
  Top 0.203: IC36.16 18.95,35.66 17.76,35.66 15.04,32.94 IC32.9
N$63
  Top 0.203: IC36.17 18.56,35.35 17.97,35.35 15.53,32.91 IC32.8
N$64
  Top 0.203: IC36.18 18.23,34.97 18.06,34.97 16.03,32.94 IC32.7
N$65
  Top 0.203: IC36.19 16.53,31.49 IC32.6
N$66
  Top 0.203: IC36.20 17.03,31.28 IC32.5
N$67
  Top 0.203: IC36.21 17.53,31.08 IC32.4
N$68
  Top 0.203: IC36.22 18.03,30.87 IC32.3
N$69
  Top 0.203: IC32.18 18.03,22.14 19.46,20.71 R119.1
N$70
  Top 0.203: IC32.17 17.53,22 18.62,20.91 R119.2
N$71
  Top 0.203: IC32.16 17.03,21.86 17.82,21.07 R119.3
N$72
  Top 0.203: IC32.15 16.53,21.75 16.98,21.3 R119.4
N$73
  Top 0.203: IC32.14 16.03,21.71 15.49,21.18 R120.1
N$74
  Top 0.203: IC32.13 15.53,21.82 14.65,20.95 R120.2
N$75
  Top 0.203: IC32.12 15.04,21.91 13.86,20.73 R120.3
N$76
  Top 0.203: IC32.11 14.59,21.98 13.02,20.41 R120.4
N$77
  Top 0.203: IC36.24 22.4,29.81 IC33.10
N$78
  Top 0.203: IC36.2 23.35,30.56 IC33.8
N$79
  Top 0.203: IC36.3 23.85,30.77 IC33.7
N$80
  Top 0.203: IC36.4 24.35,30.98 IC33.6
N$81
  Top 0.203: IC36.5 24.85,31.18 IC33.5
N$82
  Top 0.203: IC36.6 25.35,31.39 IC33.4
N$83
  Top 0.203: IC36.7 25.85,31.88 IC33.3
N$84
  Top 0.203: IC33.18 25.85,22.09 27.35,20.59 R121.1
N$85
  Top 0.203: IC33.17 25.35,21.95 26.51,20.79 R121.2
N$86
  Top 0.203: IC33.16 24.85,21.82 25.71,20.96 R121.3
N$87
  Top 0.203: IC33.15 24.35,21.64 24.87,21.12 R121.4
N$88
  Top 0.203: IC33.14 23.85,21.62 23.37,21.14 R122.1
N$89
  Top 0.203: IC33.13 23.35,21.78 22.53,20.96 R122.2
N$90
  Top 0.203: IC33.12 22.85,21.84 21.73,20.71 R122.3
N$91
  Top 0.203: IC33.11 22.4,21.92 20.89,20.41 R122.4
N$92
  Top 0.203: IC37.15 35.28,35.95 33.71,35.95 30.31,32.55 IC34.10
N$93
  Top 0.203: IC37.16 34.93,35.6 33.82,35.6 30.75,32.53 IC34.9
N$94
  Top 0.203: IC37.17 34.59,35.22 33.92,35.22 31.25,32.56 IC34.8
N$95
  Top 0.203: IC37.18 34.28,34.83 34.02,34.83 31.75,32.56 IC34.7
N$96
  Top 0.203: IC37.19 32.25,31.27 IC34.6
N$97
  Top 0.203: IC37.20 32.75,31.06 IC34.5
N$98
  Top 0.203: IC37.21 33.25,30.85 IC34.4
N$99
  Top 0.203: IC37.22 33.75,30.64 IC34.3
N$100
  Top 0.203: IC34.18 33.75,22.11 35.35,20.52 R123.1
N$101
  Top 0.203: IC34.17 33.25,22 34.51,20.75 R123.2
N$102
  Top 0.203: IC34.16 32.75,21.82 33.71,20.86 R123.3
N$103
  Top 0.203: IC34.15 32.25,21.62 32.87,21.01 R123.4
N$104
  Top 0.203: IC34.14 31.75,21.6 31.3,21.14 31.3,18.5 R124.1
N$105
  Top 0.203: IC34.13 31.25,21.71 30.49,20.95 R124.2
N$106
  Top 0.203: IC34.12 30.75,21.8 29.69,20.75 R124.3
N$107
  Top 0.203: IC34.11 30.31,21.92 28.85,20.46 R124.4
N$108
  Top 0.203: IC37.2 39.49,30.32 IC35.8
N$109
  Top 0.203: IC37.3 39.99,30.53 IC35.7
N$110
  Top 0.203: IC37.4 40.49,30.74 IC35.6
N$111
  Top 0.203: IC37.5 40.99,30.95 IC35.5
N$112
  Top 0.203: IC37.6 41.49,31.15 IC35.4
N$113
  Top 0.203: IC37.7 41.99,31.64 IC35.3
N$114
  Top 0.203: IC37.1 38.99,30.12 IC35.9
N$115
  Top 0.203: IC37.24 38.55,29.57 IC35.10
N$116
  Top 0.203: IC35.18 41.99,22.07 43.59,20.48 R125.1
N$117
  Top 0.203: IC35.17 41.49,21.86 42.75,20.61 R125.2
N$118
  Top 0.203: IC35.16 40.99,21.7 41.95,20.74 R125.3
N$119
  Top 0.203: IC35.15 40.49,21.55 41.11,20.93 R125.4
N$120
  Top 0.203: IC35.14 39.99,21.57 39.41,20.98 R126.1
N$121
  Top 0.203: IC35.13 39.49,21.72 38.57,20.8 R126.2
N$122
  Top 0.203: IC35.12 38.99,21.85 37.77,20.63 R126.3
N$123
  Top 0.203: IC35.11 38.55,22.01 36.93,20.39 R126.4
QSPI_SCLK
  Top 0.2: IC2.52 27.37,63.55 26.84,64.08 24.82,64.08 22.36,66.55 IC4.6
QSPI_SD0
  Top 0.2: IC2.53 26.97,63.32 26.51,63.79 24.71,63.79 23.22,65.27 IC4.5
QSPI_SD1
  Top 0.2: IC2.55 26.17,63.06 26.03,63.2 24.48,63.2 23.41,64.26 19.97,64.26 18.13,66.11 15.12,66.11 14.77,66.47 14.77,67.54 15.04,67.81 IC4.2
QSPI_SD2
  Top 0.2: IC2.54 26.57,63.17 26.26,63.49 24.6,63.49 23.53,64.55 20.09,64.55 18.1,66.55 IC4.3
QSPI_SD3
  Top 0.2: IC2.51 27.77,63.56 26.95,64.38 24.93,64.38 22.84,66.47 22.84,67.23 22.26,67.81 IC4.7
RP2040_RST  (via drill 0.15)
  Top 0.203: R75.2 33.13,76.97 | 33.13,76.97 31.7,76.97 30.92,76.19 RESET.1 | IC2.26 30.17,55.15 30.47,54.84 32.41,54.84 v32.53,54.96 | v32.93,75.56 33.13,75.76 33.13,76.97 | X3.B18 14.27,63.77 17.48,60.56 18.98,60.56 v19.13,60.41
  Bottom 0.203: v32.93,75.56 31.23,73.86 31.23,68.28 31.27,68.24 31.27,67.81 31.23,67.77 31.23,56.26 v32.53,54.96 33.08,54.96 33.73,54.31 33.73,52.66 33.28,52.21 28.83,52.21 26.78,54.26 25.78,54.26 23.63,56.41 23.63,59.61 22.83,60.41 v19.13,60.41
RP_USBD_N
  Top 0.155: R6.2 30.66,70.35 29.7,70.35 28.76,69.42 28.76,65.2 29.77,64.19 IC2.46
RP_USBD_P
  Top 0.155: R7.2 30.66,70.7 29.55,70.7 28.42,69.56 28.42,65.05 29.3,64.17 29.37,64.1 IC2.47
RP_XI
  Top 0.203: IC2.20 27.77,55.08 26.77,54.08 26.77,51.82 R9.1 25.9,47.46 25.6,47.16 X1.1 23.91,47.82 C1.1
RP_XO
  Top 0.203: IC2.21 28.17,54.91 27.56,54.3 R1.2
SPI0_CS0  (via drill 0.15)
  Top 0.203: IC2.7 20.65,59.29 19.41,58.05 19.41,43.75 21.86,41.29 | IC36.9 24.73,37.56 24.73,39.36 23.93,40.16 23,40.16 21.86,41.29 | X3.A2 6.88,24.68 6.88,26.16 7.48,26.76 10.48,26.76 12.53,28.81 12.53,33.66 15.98,37.11 v16.03,37.11 | v22.28,41.61 22.18,41.61 21.86,41.29 | CS0.TP 34.02,46.44 31.23,43.66 23.08,43.66 v22.93,43.51
  Bottom 0.203: v16.03,37.11 16.73,37.81 16.73,38.35 18.59,40.21 20.18,40.21 21.58,41.61 22.18,41.61 | 22.18,41.61 v22.28,41.61 | v22.93,43.51 22.93,42.36 22.18,41.61
SPI0_CS1  (via drill 0.15)
  Top 0.203: IC37.9 41.13,38.02 v41.13,39.56 | CS1.TP 37.27,44.29 v36.18,43.21 35.8,42.83 20.75,42.83 20.05,43.53 | IC2.8 20.66,58.89 19.7,57.93 19.7,43.87 20.05,43.53 | X3.A3 5.89,25.67 7.27,27.05 10.36,27.05 12.24,28.93 12.24,33.78 14.92,36.47 14.92,36.95 v15.98,38.01 | v20.31,43.64 20.2,43.53 20.05,43.53
  Bottom 0.203: v41.13,39.56 40.63,40.06 40.63,45.16 40.13,45.66 38.83,45.66 36.38,43.21 v36.18,43.21 | v15.98,38.01 20.48,42.51 20.48,43.47 v20.31,43.64
SPI0_MISO  (via drill 0.15)
  Top 0.203: IC2.6 20.63,59.69 19.11,58.17 19.11,43.63 23.32,39.42 v23.64,39.42 | v21.76,39.34 21.76,38.38 22.28,37.86 22.28,37.24 IC36.12 | MISO.TP 39.77,43.07 v39.68,43.16 39.68,41.84 39.06,41.22 39.06,40.8 39.58,40.28 39.58,38.59 IC37.12
  Bottom 0.203: v39.68,43.16 37.92,41.4 27.06,41.4 25.08,39.42 v23.64,39.42 21.84,39.42 v21.76,39.34 21.43,39.01 19.27,39.01 16.41,36.15 14.74,36.15 14.48,36.41 14.48,36.81 13.93,37.36 13.38,37.36 11.85,35.83 X3.B7
  Bottom 1.016: X3.A7 X3.B7
SPI0_MOSI  (via drill 0.15)
  Top 0.203: IC2.5 20.62,60.09 18.82,58.29 18.82,43.51 23.77,38.56 v24.03,38.56 | v22.46,38.64 22.83,38.28 22.83,37.08 IC36.11 | MOSI.TP 39.59,45.07 v39.58,45.06 | IC37.11 40.1,38.4 v40.1,39.41 | X3.B6 10.86,33.29 13.78,36.21 v13.78,36.66
  Bottom 0.203: v39.58,45.06 40.33,44.31 40.33,42.71 39.95,42.33 | 39.95,42.33 38.72,41.1 27.21,41.1 24.67,38.56 v24.03,38.56 22.55,38.56 v22.46,38.64 19.31,38.64 16.53,35.86 14.58,35.86 v13.78,36.66 | v40.1,39.41 40.1,42.19 39.95,42.33
  Bottom 1.016: X3.A6 X3.B6
SPI0_SCK  (via drill 0.15)
  Top 0.203: IC2.4 20.61,60.49 18.53,58.41 18.53,43.31 19.43,42.41 | IC36.10 23.33,36.87 23.33,37.71 | 19.43,42.41 23.33,38.51 23.33,37.71 | SCK.TP 39.64,41.07 v39.58,41.01 | v23.93,37.71 23.33,37.71 | IC37.10 40.61,38.21 v40.61,38.71 | X3.B5 11.32,30.75 11.95,31.38 11.95,33.9 14.44,36.4 14.44,37.42 v14.93,37.91 | v19.08,42.01 19.43,42.36 19.43,42.41
  Bottom 0.203: v39.58,41.01 39.38,40.81 | 39.38,40.81 27.33,40.81 24.23,37.71 v23.93,37.71 | 39.38,40.81 39.58,40.61 39.58,39.2 39.88,38.89 40.31,38.89 40.49,38.71 v40.61,38.71 | v14.93,37.91 15.88,38.86 16.42,38.86 19.02,41.47 19.02,41.95 v19.08,42.01
  Bottom 1.016: X3.A5 X3.B5
SPI1_CS  (via drill 0.15)
  Top 0.203: IC2.16 26.17,55.05 25.98,54.86 23.98,54.86 v22.33,53.21 | X3.B29 8.18,91.71 8.98,90.91 8.98,88.48 10.2,87.27 15.14,87.27 17.43,84.97 17.43,83.11 17.03,82.71 16.18,82.71 15.48,83.41 v14.93,83.41
  Bottom 0.203: v22.33,53.21 21.55,53.21 20.18,54.58 19.47,54.58 16.2,57.85 16.2,70.7 15.15,71.75 15.15,83.19 v14.93,83.41
  Bottom 1.016: X3.A29 X3.B29
SPI1_MISO  (via drill 0.15)
  Top 0.203: IC2.15 25.77,55.25 25.72,55.2 23.87,55.2 22.88,54.21 22.13,54.21 v21.93,54.01 | v15.33,84.76 15.33,85.66 14.7,86.29 10.07,86.29 X3.B26
  Bottom 0.203: v21.93,54.01 21.17,54.01 20.3,54.88 19.59,54.88 16.5,57.97 16.5,70.82 15.45,71.87 15.45,84.64 v15.33,84.76
  Bottom 1.016: X3.A26 X3.B26
SPI1_MOSI  (via drill 0.15)
  Top 0.203: IC2.14 24.71,56.49 22.98,54.76 v21.53,54.76 | v16.01,84.01 16.01,85.48 14.86,86.63 X3.B27
  Bottom 0.203: v21.53,54.76 20.83,54.76 20.42,55.17 19.71,55.17 16.79,58.09 16.79,70.94 15.74,71.99 15.74,83.73 v16.01,84.01
  Bottom 1.016: X3.A27 X3.B27
SPI1_SCK  (via drill 0.15)
  Top 0.203: IC2.13 24.56,56.89 23.13,55.46 v21.18,55.46 | v16.53,83.31 16.53,85.46 15.02,86.97 10.07,86.97 X3.B28
  Bottom 0.203: v21.18,55.46 19.83,55.46 17.08,58.21 17.08,71.06 16.03,72.11 16.03,82.81 v16.53,83.31
  Bottom 1.016: X3.A28 X3.B28
SWCLK  (via drill 0.15)
  Top 0.203: X3.B23 20.02,76.47 DBG2.1 | IC2.24 29.37,55.12 30.23,54.26 31.53,54.26 v32.83,52.96
  Bottom 0.203: v32.83,52.96 32.53,52.66 29.33,52.66 27.31,54.68 25.99,54.68 24.3,56.37 24.3,60.97 21.34,63.93 21.34,76.07 DBG2.1
SWDIO  (via drill 0.15)
  Top 0.203: X3.B24 8.57,78.31 18.98,78.31 19.53,78.86 19.53,81.06 DBG2.3 | IC2.25 29.77,55.13 30.35,54.55 31.94,54.55 32.73,53.76 v32.83,53.76
  Bottom 0.203: v32.83,53.76 32.03,52.96 29.5,52.96 27.49,54.97 26.11,54.97 24.62,56.45 24.62,61.06 21.63,64.05 21.63,80.96 20.58,82.01 DBG2.3
UART0_RX  (via drill 0.15)
  Top 0.203: IC2.2 17.81,61.29 13.97,65.12 13.97,72.02 16.27,74.32 17.18,74.32 | 17.18,74.32 21.85,74.32 23.06,75.52 DBG1.1 | v17.13,73.76 17.18,73.81 17.18,74.32
  Top 0.254: X3.B20 7.87,69.15 9.43,70.71 9.43,75.06 10.48,76.11 17.13,76.11 v17.63,75.61
  Bottom 0.254: v17.63,75.61 17.63,74.26 v17.13,73.76
UART0_TX
  Top 0.203: IC2.3 23.72,60.89 23.61,61 17.69,61 13.68,65 13.68,72.15 16.15,74.61 20.69,74.61 21.87,75.79 21.87,78.36 | 21.87,78.36 21.87,80.93 22.91,81.97 DBG1.3 | X3.B21 6.58,72.69 6.58,76.8 7.71,77.94 19.18,77.94 19.61,78.36 21.87,78.36
USB_BOOT
  Top 0.203: R4.1 17.68,73.31 18.21,73.83 22.34,73.83 24.71,76.2 USB_BOOT.1
USB_SHIELD  (1 unrouted)
  Top 0.61: C115.1 R68.1 44.91,103.33 USBC.S2 USBC.S4 | USBC.S3 USBC.S1
USBD_N
  Top 0.155: R6.1 32.72,70.36 34.17,70.36 49.28,85.46 49.28,95.67 | 49.28,95.67 49.28,101.44 49.14,101.58 49.14,101.73 | 49.14,101.73 USBC.A7 | USBC.B7 50.14,101.8 50.06,101.72 49.16,101.72 49.14,101.73 | ESD1.3 49.31,95.7 49.28,95.67
USBD_P
  Top 0.155: R7.1 32.73,70.7 34.03,70.7 48.93,85.61 48.93,95.67 | 48.93,95.67 48.93,101.27 48.64,101.56 USBC.B6 48.64,103.37 48.78,103.52 49.52,103.52 49.64,103.4 USBC.A6 | ESD1.2 48.9,95.7 48.93,95.67
V_OUT_REF  (via drill 0.15)
  Top 0.203: IC35.19 42.49,24.07 C166.1 | IC34.19 34.25,24.05 C162.1 | IC33.19 26.35,24.09 C158.1 | IC32.19 18.53,24.29 C153.1 | R22.1 16.93,39.96 IC38.2 13.76,39.96 13.26,40.46 IC38.6
  Top 0.406: C153.1 R127.1 C154.1 | C154.1 | C158.1 27.84,23.66 R8.1 28.9,23.68 C157.1 28.94,24.52 v28.98,24.56 | C162.1 35.75,23.64 R10.1 C161.1 36.85,24.53 v36.88,24.56 | C166.1 R11.1 43.98,23.68 C165.1 45.07,24.8 v45.13,24.86 | R22.1 16.96,36.66 13.31,33.01 13.31,25.36 13.63,25.05 v13.63,24.86 | DIO_VREF.TP v46.69,24.9 v46.68,24.91 | v21.28,24.61 21.21,24.54 C154.1
  Bottom 0.406: v46.68,24.91 45.18,24.91 v45.13,24.86 44.83,24.56 v36.88,24.56 v28.98,24.56 21.33,24.56 | 21.33,24.56 v21.28,24.61 | v13.63,24.86 19.28,24.86 19.58,24.56 21.33,24.56
VBUS  (via drill 0.15)
  Top 0.2: USBC.B9 51.68,102.61 51.79,102.61 USBC.A4
  Top 0.203: USBC.A9 46.99,102.61 USBC.B4 | ESD1.4 51.54,97.6 51.74,97.41 51.9,97.24 | 35.03,98.86 38.13,98.86 39.43,100.16 44.33,100.16 44.93,100.76 46.03,100.76 46.03,100.36 45.43,99.76 45.43,97.66 43.33,95.56 35.23,95.56 34.73,96.06 34.73,98.66 34.93,98.86
  Top 0.254: USBC.A9 46.84,103.02 47.78,103.96 50.93,103.96 51.68,103.21 51.68,102.61
  Top 0.61: 51.79,102.61 51.79,101.48 52.47,100.8 R5.1 52.47,98.52 51.74,97.78 51.74,97.41 | 51.9,97.24 C78.1 51.68,96.83 R63.1 | 46.99,102.61 46.99,101.42 46.49,100.92 C79.1 45.55,100.49 VBUS.TP
  Top 0.813: D1.A 36.34,98.49 VBUS.TP
  Bottom 2.54: v36.33,97.46 v39.33,97.46
  other vias: 35.33,96.46 35.33,97.46 35.33,98.46 36.33,98.46 37.33,98.46 38.33,98.46 39.33,98.46 40.33,98.46 40.33,97.46 40.33,96.46 39.33,96.46 38.33,96.46 36.33,96.46 37.33,96.46 37.33,97.46 38.33,97.46
  pour Top (isolate 0.203, no thermals): 34.83,98.76 34.93,98.86 37.33,98.86 38.13,98.86 39.23,99.96 39.43,100.16 43.93,100.16 44.33,100.16 44.73,100.56 44.93,100.76 46.83,100.76 46.83,100.26 45.93,100.26 45.43,99.76 45.43,97.66 43.33,95.56 35.53,95.56 35.23,95.56 34.73,96.06 34.73,98.66
VREF
  Top 0.203: VREF1.TP 38.49,57.49 37.93,58.06 37.93,62.22 C3.1
  Top 0.254: 36.99,64.37 36.99,65.7 IC3.3 37.1,65.81 38.46,65.81 | 36.99,64.37 36.99,63.16 C3.1 | C4.1 38.6,65.81 38.46,65.81 | 38.46,65.81 38.46,65.97 REF1.1 38.23,66.28 | R2.1 37.05,64.42 36.99,64.37

## Text on the board
tNames: Module - DIO, Rev 1.0 | github.com/DvidMakesThings/HW_10-In-Rack_DAQ | +3.3V_EN | SN-729618080225 | +5V_EXT_EN
bNames: SN-729618080225